# EAGLE design can4vscp_usb_rev_B (EAGLE 6.6.0)
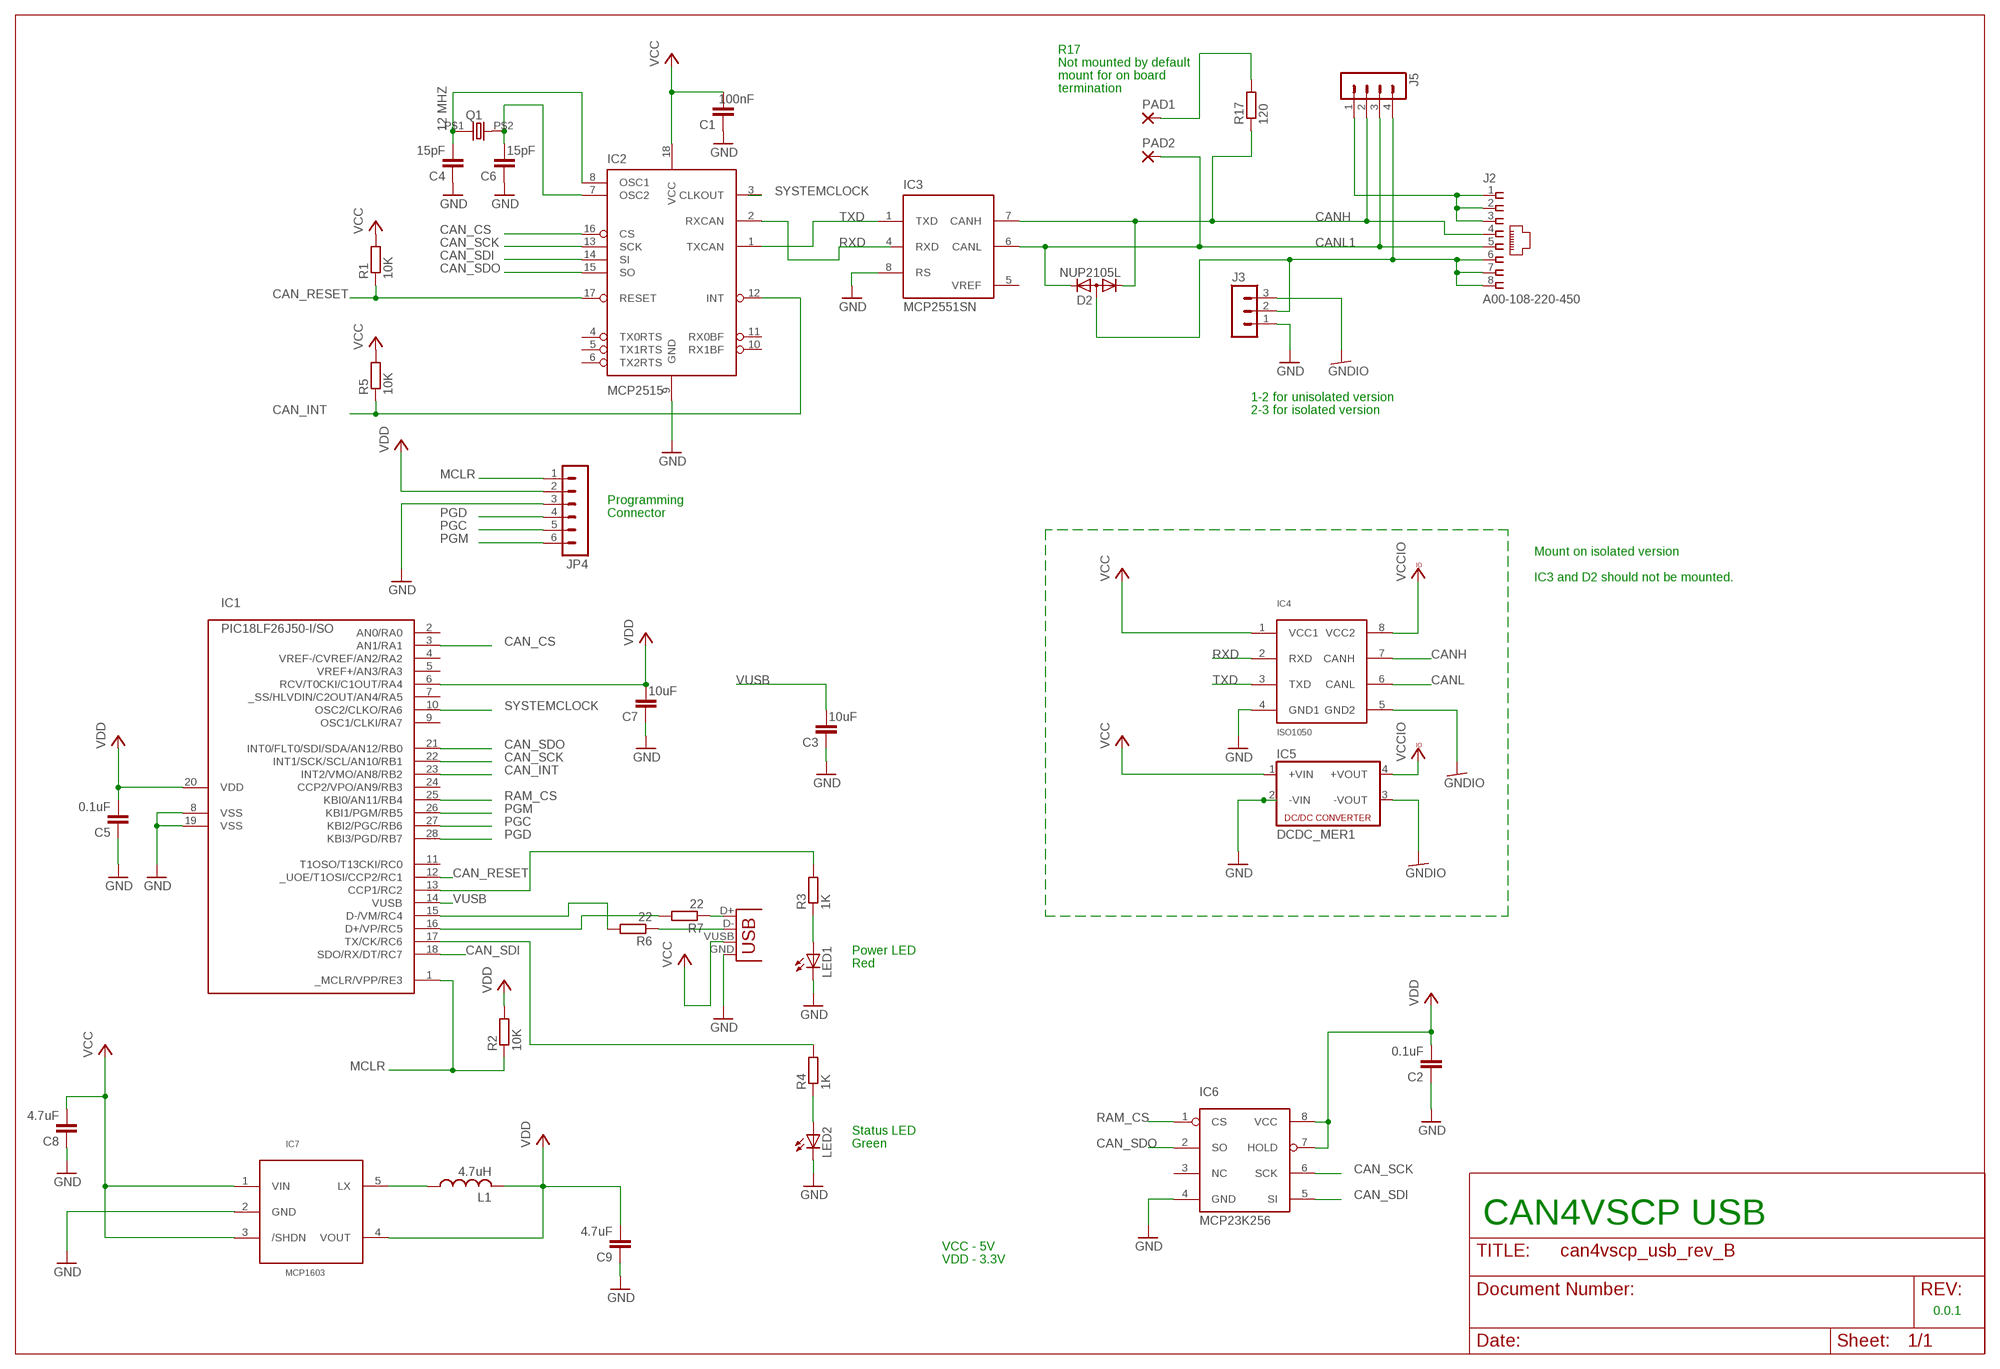
[diagram p0: schematic, sheet 1]

## Parts
C1  100nF  C-EUC0805  [C0805]
C2  0.1uF  C-EUC0805  [C0805]
C3  10uF  C-EUC0805  [C0805]
C4  15pF  C-EUC0805  [C0805]
C5  0.1uF  C-EUC0805  [C0805]
C6  15pF  C-EUC0805  [C0805]
C7  10uF  C-EUC0805  [C0805]
C8  4.7uF  C-EUC0805  [C0805]
C9  4.7uF  C-EUC0805  [C0805]
D2  NUP2105L  DIODE-2CA|ACSOT23  [SOT23]
IC1  PIC18LF26J50-I/SO  PIC18LF2550-I/SO  [SO-28W]
IC2  MCP2515  [SO-18W]
IC3  MCP2551SN  [SO-08]
IC4  ISO1050  [DUB_PSOP]
IC5  DCDC_MER1  [MER1]
IC6  MCP23K256  MCP23A256  [SO-8]
IC7  MCP1603  [SOT23-5L]
J2  A00-108-220-450  [RJ-45]
J3  MA03-1  [MA03-1]
J4  USB-B-S  [USB-B-SMT]
J5  MA04-1  [MA04-1]
JP4  MA06-1  [MA06-1]
L1  4.7uH  L-USL2012C  [L2012C]
LED1  LEDCHIP-LED0805  [CHIP-LED0805]
LED2  LEDCHIP-LED0805  [CHIP-LED0805]
PAD1  1,6/0,8  [1,6/0,8]
PAD2  1,6/0,8  [1,6/0,8]
Q1  12 MHZ  HC-49S  [9C]
R1  10K  R-EU_R0805  [R0805]
R2  10K  R-EU_R0805  [R0805]
R3  1K  R-EU_R0805  [R0805]
R4  1K  R-EU_R0805  [R0805]
R5  10K  R-EU_R0805  [R0805]
R6  22  R-EU_R0805  [R0805]
R7  22  R-EU_R0805  [R0805]
R17  120  R-EU_R0805  [R0805]

## Nets
CAN_CS: IC1.3(AN1/RA1) IC2.16(CS)
CAN_INT: IC1.23(INT2/VMO/AN8/RB2) IC2.12(INT) R5.1
CAN_RESET: IC1.12(_UOE/T1OSI/CCP2/RC1) IC2.17(RESET) R1.1
CAN_SCK: IC1.22(INT1/SCK/SCL/AN10/RB1) IC2.13(SCK) IC6.6(SCK)
CAN_SDI: IC1.18(SDO/RX/DT/RC7) IC2.14(SI) IC6.5(SI)
CAN_SDO: IC1.21(INT0/FLT0/SDI/SDA/AN12/RB0) IC2.15(SO) IC6.2(SO)
CANH: D2.1(K1) IC3.7(CANH) IC4.7(CANH) J2.4 J5.2 R17.1
CANL: IC4.6(CANL)
CANL1: D2.2(K2) IC3.6(CANL) J2.5 J5.3 PAD2.1(P)
GND: C1.1 C2.1 C3.1 C4.1 C5.1 C6.1 C7.1 C8.1 C9.1 IC1.8(VSS) IC1.19(VSS) IC2.9(GND) IC3.8(RS) IC4.4(GND1) IC5.2(-VIN) IC6.4(GND) IC7.2(GND) J3.1 J4.GND JP4.3 LED1.C LED2.C
GNDIO: IC4.5(GND2) IC5.3(-VOUT) J3.3
MCLR: IC1.1(_MCLR/VPP/RE3) JP4.1 R2.1
N$1: IC1.16(D+/VP/RC5) R7.2
N$2: C4.2 IC2.8(OSC1) Q1.P$1
N$3: IC1.15(D-/VM/RC4) R6.2
N$4: LED2.A R4.1
N$5: LED1.A R3.1
N$6: IC1.13(CCP1/RC2) R3.2
N$7: C6.2 IC2.7(OSC2) Q1.P$2
N$9: D2.3(A) J2.6 J2.7 J2.8 J3.2 J5.4
N$10: IC1.17(TX/CK/RC6) R4.2
N$11: PAD1.1(P) R17.2
N$12: J2.1 J2.2 J2.3 J5.1
N$13: J4.D- R6.1
N$14: J4.D+ R7.1
N$16: IC7.5(LX) L1.1
PGC: IC1.27(KBI2/PGC/RB6) JP4.5
PGD: IC1.28(KBI3/PGD/RB7) JP4.4
PGM: IC1.26(KBI1/PGM/RB5) JP4.6
RAM_CS: IC1.25(KBI0/AN11/RB4) IC6.1(CS)
RXD: IC2.2(RXCAN) IC4.2(RXD)
SYSTEMCLOCK: IC1.10(OSC2/CLKO/RA6) IC2.3(CLKOUT)
TXD: IC2.1(TXCAN) IC3.1(TXD) IC4.3(TXD)
VCC: C1.2 C8.2 IC2.18(VCC) IC4.1(VCC1) IC5.1(+VIN) IC7.1(VIN) IC7.3(/SHDN) J4.VUSB(VBUS) R1.2 R5.2
VCCIO: IC4.8(VCC2) IC5.4(+VOUT)
VDD: C2.2 C5.2 C7.2 C9.2 IC1.6(RCV/T0CKI/C1OUT/RA4) IC1.20(VDD) IC6.7(HOLD) IC6.8(VCC) IC7.4(VOUT) JP4.2 L1.2 R2.2
VUSB: C3.2 IC1.14(VUSB)
Unconnected: IC1.2(AN0/RA0) IC1.4(VREF-/CVREF/AN2/RA2) IC1.5(VREF+/AN3/RA3) IC1.7(_SS/HLVDIN/C2OUT/AN4/RA5) IC1.9(OSC1/CLKI/RA7) IC1.11(T1OSO/T13CKI/RC0) IC1.24(CCP2/VPO/AN9/RB3) IC2.4(TX0RTS) IC2.5(TX1RTS) IC2.6(TX2RTS) IC2.10(RX1BF) IC2.11(RX0BF) IC3.4(RXD) IC6.3(NC)

## Notes on the sheet
- R17
- Not mounted by default
- mount for on board
- termination
- 1-2 for unisolated version
- 2-3 for isolated version
- Programming
- Connector
- Mount on isolated version
- IC3 and D2 should not be mounted.
- Power LED
- Red
- Status LED
- Green
- CAN4VSCP USB
- VCC - 5V
- VDD - 3.3V
- 0.0.1

## Power pins joined to a net without a drawn wire
GND: IC3.2(VSS)
VCC: IC3.3(VDD)
VREF: IC3.5(VREF)

## Library data of the parts
C1-C9 = rcl:C-EU: CAPACITOR, European symbol
D2 = diode:DIODE-2CA|AC: Dual DIODE Cathode-Anode|Anode-Cathode
IC1 = microchip-pic18fxx5x:PIC18*2550: PIC18*2550 Microchip FLASH Microcontroller with FS-USB DEVICE FEATURES Feature PIC18*2550 Program Memory (bytes) 32k Program Memory (instructions) 16384 I/O Ports Ports A, B, C, (E) Capture/Compare/PWM Modules 2 Enhanced Capture/Compare/PWM Modules 0 Parallel Communications (PSP) No 10-bit Analog-to-Digital Module 10 input Channels Package Types 28-pin PDIP 28-pin SOIC NOTES: F only after 18, means standard voltage range from 4.2v to 5.5v LF after 18, means extended voltage range from 2.0v to 5.5v T after entire device number, means supplied in tape and reel TQFP packages only -E before / denotes extended temperature range from -40°C to +120°C -I before / denotes industrial temperature range from -40°C to +85°C /PT suffix denotes TQFP package /SO suffix denotes SOIC package /SP suffix denotes Skinny Plastic DIP package /P suffix denotes Plastic DIP package /ML suffix denotes QFN package
IC2 = vscpcan:MCP2515
IC3 = microchip_can:MCP2551: High Speed CAN tranceiver
IC4 = vscpcan:ISO1050
IC5 = vscpcan:DCDC_MER1
IC6 = vscpcan:MCP23A256
IC7 = eurosource_mcp1603:MCP1603
J2 = vscpcan:A00-108-220-450
J3 = con-lstb:MA03-1: PIN HEADER; OC_FARNELL: unknown; OC_NEWARK: unknown
J4 = con-usb:USB: USB Connectors
J5 = con-lstb:MA04-1: PIN HEADER; OC_FARNELL: unknown; OC_NEWARK: unknown
JP4 = con-lstb:MA06-1: PIN HEADER; OC_FARNELL: unknown; OC_NEWARK: unknown
L1 = rcl:L-US: INDUCTOR, American symbol
LED1 LED2 = led:LED: LED OSRAM: - CHIPLED LG R971, LG N971, LY N971, LG Q971, LY Q971, LO R971, LY R971 LH N974, LH R974 LS Q976, LO Q976, LY Q976 LO Q996 - Hyper CHIPLED LW Q18S LB Q993, LB Q99A, LB R99A - SideLED LS A670, LO A670, LY A670, LG A670, LP A670 LB A673, LV A673, LT A673, LW A673 LH A674 LY A675 LS A676, LA A676, LO A676, LY A676, LW A676 LS A679, LY A679, LG A679 - Hyper Micro SIDELED® LS Y876, LA Y876, LO Y876, LY Y876 LT Y87S - SmartLED LW L88C, LW L88S LB L89C, LB L89S, LG L890 LS L89K, LO L89K, LY L89K LS L896, LA L896, LO L896, LY L896 - TOPLED LS T670, LO T670, LY T670, LG T670, LP T670 LSG T670, LSP T670, LSY T670, LOP T670, LYG T670 LG T671, LOG T671, LSG T671 LB T673, LV T673, LT T673, LW T673 LH T674 LS T676, LA T676, LO T676, LY T676, LB T676, LH T676, LSB T676, LW T676 LB T67C, LV T67C, LT T67C, LS T67K, LO T67K, LY T67K, LW E67C LS E67B, LA E67B, LO E67B, LY E67B, LB E67C, LV E67C, LT E67C LW T67C LS T679, LY T679, LG T679 LS T770, LO T770, LY T770, LG T770, LP T770 LB T773, LV T773, LT T773, LW T773 LH T774 LS E675, LA E675, LY E675, LS T675 LS T776, LA T776, LO T776, LY T776, LB T776 LHGB T686 LT T68C, LB T68C - Hyper Mini TOPLED® LB M676 - Mini TOPLED Santana® LG M470 LS M47K, LO M47K, LY M47K Source: http://www.osram.convergy.de LUXEON: - LUMILED® LXK2-PW12-R00, LXK2-PW12-S00, LXK2-PW14-U00, LXK2-PW14-V00 LXK2-PM12-R00, LXK2-PM12-S00, LXK2-PM14-U00 LXK2-PE12-Q00, LXK2-PE12-R00, LXK2-PE12-S00, LXK2-PE14-T00, LXK2-PE14-U00 LXK2-PB12-K00, LXK2-PB12-L00, LXK2-PB12-M00, LXK2-PB14-N00, LXK2-PB14-P00, LXK2-PB14-Q00 LXK2-PR12-L00, LXK2-PR12-M00, LXK2-PR14-Q00, LXK2-PR14-R00 LXK2-PD12-Q00, LXK2-PD12-R00, LXK2-PD12-S00 LXK2-PH12-R00, LXK2-PH12-S00 LXK2-PL12-P00, LXK2-PL12-Q00, LXK2-PL12-R00 Source: www.luxeon.com KINGBRIGHT: KA-3528ASYC Source: www.kingbright.com
PAD1 PAD2 = wirepad:1,6/0,8: THROUGH-HOLE PAD
Q1 = vscpcan:HC-49S: Digikey 887-1050-1-nd
R1-R7 R17 = rcl:R-EU_: RESISTOR, European symbol

## Board
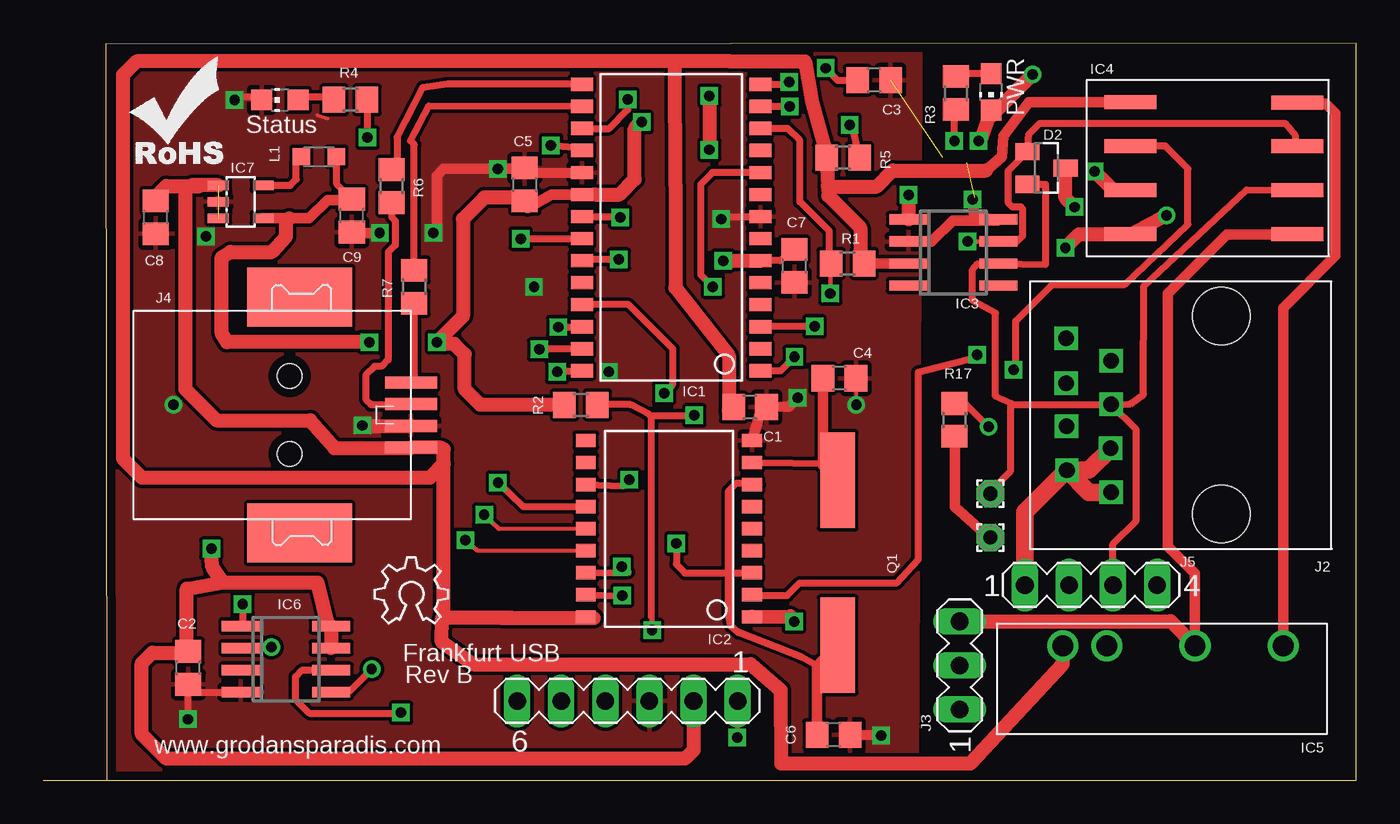
[diagram p1: board, top side]
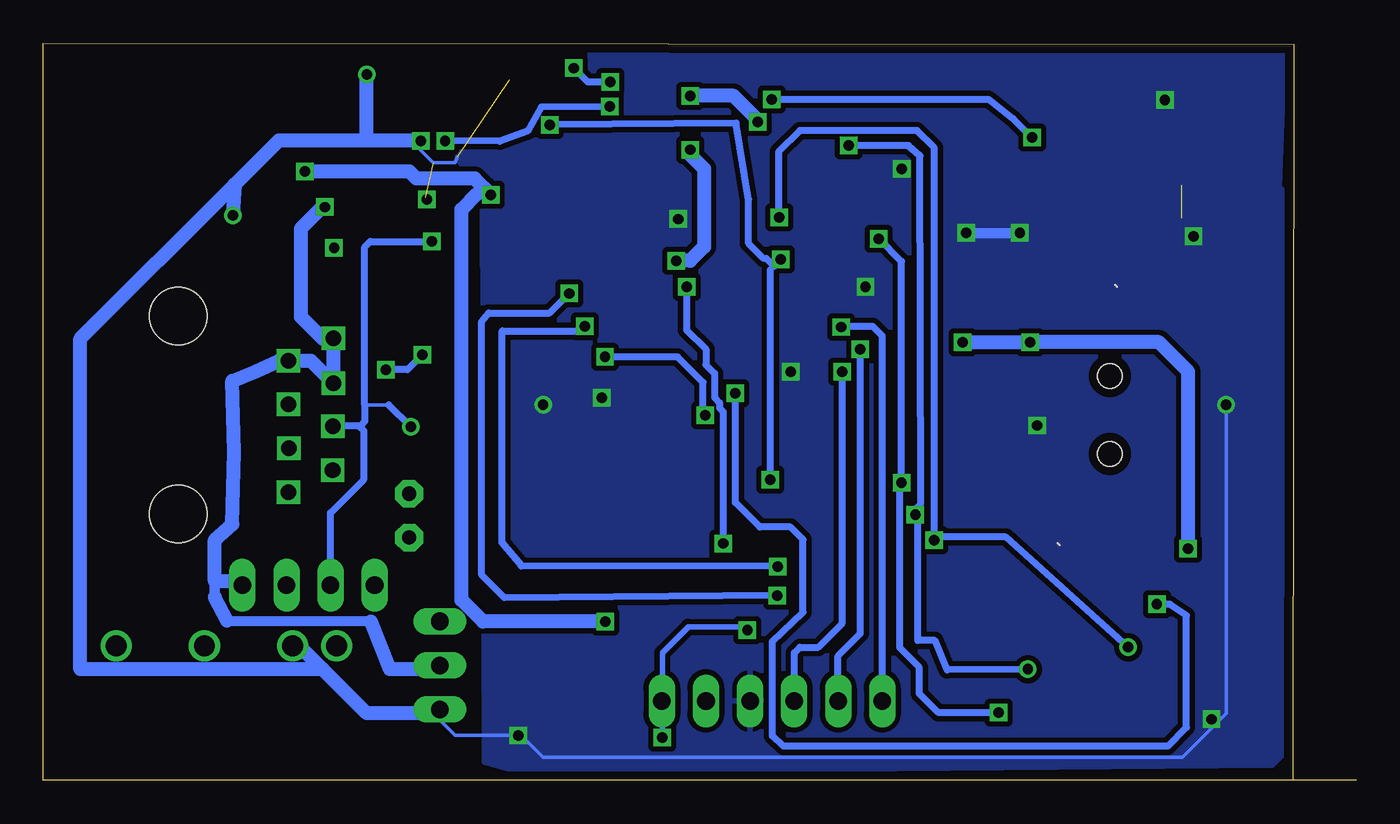
[diagram p2: board, bottom side, seen from below]

Size 75.66 x 42.48 mm. Coordinates in mm from the lower left corner, seen from the top.
Outline: 0,0 75.66,0 75.66,42.48 3.59,42.43 3.64,0.01
Copper layers (1*16): Top 0.035mm / dielectric 1.5mm / Bottom 0.035mm
Design rules "8mils": minimum track width 8mil, minimum drill 0.6mm, track to track 8mil, track to pad 8mil, pad to pad 8mil, via to via 8mil, smd to smd 0mil, copper to edge 20mil, drill to drill 10mil, minimum pad ring 8mil, minimum via ring 8mil, stop-mask expansion 0mil, vias tented up to drill 0mil, thermal gap 10mil

### Footprints (pad centres in the part's own frame; a part is rotated, then mirrored left to right if it is on the bottom)
C0805 = smd 1.3 x 1.5: 1 -0.95,0; 2 0.95,0
SOT23 = smd 1 x 1.4: 1 -0.95,-1.1; 2 0.95,-1.1; 3 0,1.1
SO-28W = smd 0.762 x 1.27: 1 -7.62,-5.207; 2 -6.35,-5.207; 3 -5.08,-5.207; 4 -3.81,-5.207; 5 -2.54,-5.207; 6 -1.27,-5.207; 7 0,-5.207; 8 1.27,-5.207; 9 2.54,-5.207; 10 3.81,-5.207; 11 5.08,-5.207; 12 6.35,-5.207; 13 7.62,-5.207; 14 8.89,-5.207; 15 8.89,5.08; 16 7.62,5.08; 17 6.35,5.08; 18 5.08,5.08; 19 3.81,5.08; 20 2.54,5.08; 21 1.27,5.08; 22 0,5.08; 23 -1.27,5.08; 24 -2.54,5.08; 25 -3.81,5.08; 26 -5.08,5.08; 27 -6.35,5.08; 28 -7.62,5.08
SO-18W = smd 0.762 x 1.143: 1 -5.08,-4.788; 2 -3.81,-4.788; 3 -2.54,-4.788; 4 -1.27,-4.788; 5 0,-4.788; 6 1.27,-4.788; 7 2.54,-4.788; 8 3.81,-4.788; 9 5.08,-4.788; 10 5.08,4.788; 11 3.81,4.788; 12 2.54,4.788; 13 1.27,4.788; 14 0,4.788; 15 -1.27,4.788; 16 -2.54,4.788; 17 -3.81,4.788; 18 -5.08,4.788
SO-08 = smd 0.6 x 2.2: 1 -1.905,-2.6; 2 -0.635,-2.6; 3 0.635,-2.6; 4 1.905,-2.6; 5 1.905,2.6; 6 0.635,2.6; 7 -0.635,2.6; 8 -1.905,2.6
DUB_PSOP = smd 0.8 x 3: 1 -2.54,0; 2 0,0; 3 2.54,0; 4 5.08,0; 5 5.08,9.6; 6 2.54,9.6; 7 0,9.6; 8 -2.5,9.6
MER1 = drill 1.2: 1 -5.08,0; 2 -2.54,0; 3 2.54,0; 4 7.62,0
SO-8 = smd 0.6 x 2.2: 1 -1.905,-2.6; 2 -0.635,-2.6; 3 0.635,-2.6; 4 1.905,-2.6; 5 1.905,2.6; 6 0.635,2.6; 7 -0.635,2.6; 8 -1.905,2.6
SOT23-5L = smd 0.55 x 1.2: 1 -0.95,-1.3; 2 0,-1.3; 3 0.95,-1.3; 4 0.95,1.3; 5 -0.95,1.3
RJ-45 = drill 0.9 square: 1 -4.45,6.35; 2 -3.17,8.89; 3 -1.92,6.36; 4 -0.65,8.91; 5 0.62,6.35; 6 1.84,8.93; 7 3.14,6.35; 8 4.42,8.93 | hole 3.3: -5.7,0; 5.7,0
MA03-1 = drill 1.016 long: 1 -2.54,0; 2 0,0; 3 2.54,0
USB-B-SMT = smd 6.04 x 3.4: 5 0.58,6.8; 6 0.58,-6.8 | smd 3 x 0.7: D+ 7,1.875; D- 7,0.625; GND 7,-0.625; VUSB 7,-1.875 | hole 1.4: 0,2.25; 0,-2.25
MA04-1 = drill 1.016 long: 1 -3.81,0; 2 -1.27,0; 3 1.27,0; 4 3.81,0
MA06-1 = drill 1.016 long: 1 -6.35,0; 2 -3.81,0; 3 -1.27,0; 4 1.27,0; 5 3.81,0; 6 6.35,0
L2012C = smd 1 x 1: 1 -1,0; 2 1,0
CHIP-LED0805 = smd 1.2 x 1.2: A 0,-1.05; C 0,1.05
1,6/0,8 = drill 0.813 pad 1.6 octagon: 1 0,0
9C = smd 5.5 x 2: P$1 -4.74,0; P$2 4.76,0
R0805 = smd 1.3 x 1.5: 1 -0.95,0; 2 0.95,0

### Placement (x,y rotation side)
C1  40.73,21.5 180 top
C2  8.35,6.48 90 top
C3  47.88,40.35 180 top
C4  45.88,23.17 180 top
C5  27.74,34.34 270 top
C6  45.55,2.63 180 top
C7  43.28,29.65 90 top
C8  6.48,32.45 90 top
C9  17.78,32.55 90 top
D2  57.81,35.29 270 top
IC1  36.12,31.22 90 top
IC2  36.05,14.5 90 top
IC3  52.45,30.42 270 top
IC4  62.66,36.56 270 top
IC5  63.84,7.75 0 top
IC6  13.98,6.99 270 top
IC7  11.38,33.35 270 top
J2  67.88,21.05 90 top
J3  52.81,6.62 90 top
J4  14.19,21.06 0 top
J5  60.38,11.25 0 top
JP4  33.66,4.57 180 top
L1  15.88,35.95 0 top
LED1  54.63,39.68 180 top
LED2  13.63,39.22 90 top
PAD1  54.58,13.99 0 top
PAD2  54.58,16.52 0 top
Q1  45.78,12.55 270 top
R1  46.35,29.79 0 top
R2  30.98,21.64 180 top
R3  52.6,39.61 270 top
R4  17.7,39.22 0 top
R5  46.09,35.89 180 top
R6  20.08,34.25 90 top
R7  21.38,28.45 90 top
R17  52.51,20.77 270 top
U$1  [OSHW_6X150_NOTEXT]  19.08,9.05 0 top
U$2  [ROHS_SILK]  7.08,37.95 0 top
U$3  [VSCP_LOGO2]  21.58,36.85 0 top

### Tracks (layer width: path | path; a pad name or v marks a point on that pad's centre or on a via)
CAN_CS  (via drill 0.6)
  Top 0.254: 41.34,26.16 IC1.3
  Top 0.406: IC2.16 33.71,11.99 v33.33,12.32 | v44.45,26.16 41.34,26.16
  Bottom 0.254: 44.71,25.9 v44.45,26.16
  Bottom 0.406: v33.33,12.32 48.1,12.35 49.23,13.69 49.23,25.34 49.21,25.9 44.71,25.9
CAN_INT  (via drill 0.6)
  Top 0.254: 33.42,16.98 v33.77,17.32 | 31.1,30.02 IC1.23 | v46.46,37.78 46.54,37.91
  Top 0.406: IC2.12 33.42,16.98 | v33.17,30.02 31.1,30.02 | 46.54,37.91 R5.1
  Bottom 0.254: 33.77,29.42 33.55,29.64 v33.17,30.02 | 33.99,30.07 34.15,30.07
  Bottom 0.406: v33.77,17.32 33.77,29.42 | v46.46,37.78 35.73,37.88 35.02,33.47 35.02,30.95 34.15,30.07 | 33.55,29.64 33.99,30.07
CAN_RESET  (via drill 0.6)
  Top 0.254: 45.29,29.8 R1.1 45.36,29.73 v45.36,28.06 | 33.56,10.63 v33.36,10.65
  Top 0.406: IC1.12 42.91,37.57 43.6,36.89 43.6,33.36 45.29,31.66 45.29,29.8 | IC2.17 33.56,10.63
  Bottom 0.406: v33.36,10.65 49.08,10.52 50.39,11.83 50.39,26.45 50,26.95 46.47,26.95 v45.36,28.06
CAN_SCK  (via drill 0.6)
  Top 0.254: IC1.22 | 20.58,3.86 v20.61,3.89
  Top 0.406: IC2.13 27.66,15.78 v26.2,17.16 | v27.51,31.22 IC1.22 | IC6.6 14.92,6.35 14.54,5.97 14.54,4.65 15.32,3.86 20.58,3.86
  Bottom 0.254: 26.31,17.06 v26.2,17.16
  Bottom 0.406: v26.2,17.16 26.2,29.91 v27.51,31.22 | v20.61,3.89 24.07,3.89 25.17,4.99 25.17,6.5 26.31,7.64 26.31,17.06
CAN_SDI  (via drill 0.6)
  Top 0.203: IC6.5 17.65,5.13
  Top 0.254: IC2.14 26.27,14.48 v25.4,15.3 | 30.89,36.45 IC1.18
  Top 0.406: v29.25,36.6 30.89,36.45 | 17.65,5.13 v18.92,6.4
  Bottom 0.203: 25.27,15.29 v25.4,15.3
  Bottom 0.254: 29.16,36.59 v29.25,36.6
  Bottom 0.406: v25.4,15.3 25.4,15.62 25.08,15.94 25.13,36 25.79,36.59 29.16,36.59 | v18.92,6.4 23.58,6.35 24.28,8.05 25.27,8.05 25.27,15.29
CAN_SDO  (via drill 0.6)
  Top 0.203: IC6.2 11.3,7.67
  Top 0.254: IC2.15 24.99,13.24 v24.31,13.85 | 31.07,32.46 IC1.21
  Top 0.406: v33.25,32.46 31.07,32.46 | 11.3,7.67 v13.14,7.67
  Bottom 0.203: 24,14.02 v24.31,13.85
  Bottom 0.254: 33.29,32.5 v33.25,32.46
  Bottom 0.406: v24.31,13.85 24.31,36.45 25.31,37.45 32.07,37.45 33.29,36.23 33.29,32.5 | v13.14,7.67 20.19,14.02 24,14.02
CANH  (via drill 0.6)
  Top 0.203: R17.1 53.21,21.64
  Top 0.254: 72.15,36.66 IC4.7 | 56.12,31.05 IC3.7 v53.27,31.05 | 56.45,32.94 56.34,33.05
  Top 0.406: 72.15,36.66 72.15,37.18 71.56,37.87 57.42,37.87 56.81,37.26 D2.1 55.61,35.14 55.61,33.28 55.84,33.05 56.34,33.05 | 56.12,31.05 56.45,31.39 56.45,32.94 | 53.21,21.64 v54.48,20.37
  Bottom 0.203: 55.75,21.64 57.14,21.64
  Bottom 0.254: 57.39,20.44 57.48,20.44 | 58.94,20.44 J2.4
  Bottom 0.406: v53.27,31.05 56.82,31.05 57.14,30.74 57.14,21.64 57.14,20.69 57.39,20.44 | 58.94,20.44 57.48,20.44 57.18,20.14 57.18,17.35 59.11,15.42 J5.2 | v54.48,20.37 55.75,21.64
CANL
  Top 0.203: 62.1,21.67 62.1,21.64
  Top 0.406: IC4.6 69.35,34.04 63.41,28.48 63.41,22.25 62.64,21.7 62.1,21.67 61.63,21.64
CANL1
  Top 0.203: PAD2.1 54.48,16.56 | 55.75,21.64 55.79,21.72
  Top 0.254: 55.79,21.72 55.94,21.66 | 53.84,29.77 IC3.6 | 61.53,21.66 J2.5
  Top 0.406: 55.79,21.72 54.88,22.13 54.88,26.93 53.55,27.66 53.55,29.43 53.84,29.77 | IC3.6 57.78,29.74 57.78,32.32 57.78,34.34 D2.2 | 55.94,21.66 61.53,21.66 | 54.48,16.56 55.75,17.83 55.75,21.64 | J5.3 61.65,13.62 62.98,14.95 62.98,20.22 J2.5
GND  (via drill 0.6)  (2 unrouted)
  Top 0.203: 12.57,39.42 LED2.C | v46.86,21.64 46.86,22.91 C4.1 | 54.48,38.15 LED1.C | 62.77,31.5 IC4.4 | 16.38,38.15 15.77,38.34
  Top 0.254: 8.35,5.08 C2.1 | IC3.2 51.2,31.05 52.25,32.1 53.38,32.1 53.7,32.41 53.7,33.55 53.65,33.59
  Top 0.305: v18.38,20.45 18.4,20.43
  Top 0.406: IC1.8 39.22,32.49 v39.08,32.35 | v53.89,36.86 54.03,36.9 | 12.57,39.42 11.3,39.42 v11.02,39.22 | IC6.4 8.35,5.08 8.35,3.98 v8.34,3.51
  Top 0.61: IC1.19 28.38,34.99 C5.1 27.83,35.25 v26.18,35.25 23.08,35.25 22.68,34.85 22.68,31.75 v22.48,31.55 | C6.1 v48.27,2.58 v48.28,2.59 | v43.48,22.05 42.98,21.55 C1.1 41.29,21.12 IC2.9 | v53.56,33.49 53.64,32.48 IC3.8 54.98,32.26 52.43,32.26 51.18,31.05 IC3.2 | v58.9,30.69 58.95,30.95 | v19.38,31.55 17.83,31.55 C9.1
  Top 0.813: 18.4,20.43 J4.GND | 54.03,36.9 LED1.C | IC4.4 59.69,31.48 v58.9,30.69 | v57.02,40.69 54.48,38.15 | v64.74,32.57 62.77,31.5
  Bottom 0.203: 54.48,36.88 53.21,35.61 51.94,35.61 51.81,35.91 | 48.13,2.59 51.94,2.59 53.21,3.86 J3.1 | 48.13,2.59 46.86,1.32 10.03,1.32 7.49,3.86 v7.49,21.64 | 48.13,2.59 v48.28,2.59
  Bottom 0.61: v22.48,31.55 v19.38,31.55
  Bottom 0.813: 57.02,36.88 v57.02,40.69 | 54.48,36.88 57.02,36.88 | 57.02,36.88 62.1,36.88 64.64,34.34 | 59.56,6.4 57.02,3.86 53.21,3.86 | 59.56,6.4 60.83,7.67 IC5.2 | 64.64,34.34 73.53,25.45 73.53,6.4 59.56,6.4 | 64.64,34.34 v64.74,32.57
  other vias: 9.38,31.35 28.28,28.45 32.58,23.55
  pour Bottom (isolate 0.305): 4.27,34.09 4.27,1.45 4.86,0.86 48.15,0.46 50.22,1.03 50.35,33.63 55.64,41.81 4.14,41.79 4.42,34.17
  pour Top: 4.27,42.07 4.27,0.42 4.41,0.27 49.61,0.47 50.35,0.42 50.55,40.87 50.56,42.17
GNDIO
  Top 0.203: 64.64,16.56 64.81,16.56
  Top 0.61: IC5.3 66.38,11.92 64.81,13.49 64.81,16.56 64.81,28.06 68.21,31.46 72.24,31.46 IC4.5
  Top 0.813: J3.3 64.97,9.16 IC5.3
MCLR  (via drill 0.6)
  Top 0.254: 35.05,21.02 34.93,21.08 34.98,21.03 | R2.1
  Top 0.305: JP4.1 40.01,2.68 v39.98,2.45 | v35.08,8.65 35.08,9.4 35.05,9.43
  Top 0.406: 35.05,9.43 35.05,21.02 | 34.93,21.08 33.83,21.65 R2.1 | IC1.1 42.49,23.6 v43.29,24.41 | 34.98,21.03 v37.52,21.03
  Bottom 0.254: v37.52,21.03 37.63,21.14
  Bottom 0.305: v39.98,2.45 39.98,7.35 38.48,8.85 35.28,8.85 v35.08,8.65
  Bottom 0.406: v43.29,24.41 39.1,24.41 37.63,22.94 37.63,21.14
N$1
  Top 0.254: IC1.16
  Top 0.406: IC1.16 22.22,38.89 21.15,36.86 21.38,36.63 R7.2
N$2
  Top 0.254: 45.54,18.25 46.03,17.75 45.78,17.5 Q1.P$1
  Top 0.406: IC2.8 45.54,18.25
  Top 0.61: C4.2 44.93,18.14 Q1.P$1
N$3
  Top 0.254: IC1.15 31.07,40.15
  Top 0.406: IC1.15 31,40.15 23.28,40.15 21.88,39.95 20.38,37.05 20.38,35.5 R6.2
N$4
  Top 0.203: LED2.A 15.11,39.42 | 16.38,39.42 R4.1
  Top 0.406: 15.11,39.42 16.38,39.42
N$5
  Top 0.406: LED1.A 52.77,40.73 R3.1
N$6  (via drill 0.6)
  Top 0.254: 43.2,38.84 v43.01,38.84
  Top 0.406: IC1.13 43.2,38.84 | v52.51,36.87 52.51,38.56 R3.2
  Bottom 0.406: v43.01,38.84 46.97,38.81 47.77,37.43 49.34,36.83 v52.51,36.87
N$7
  Top 0.254: 41.34,17.03 IC2.7 40.74,17.14
  Top 0.406: 44.6,6.61 43.66,7.11 40.06,8.52 39.62,8.89 39.49,9.5 39.49,16.68 39.94,17.14 40.74,17.14
  Top 0.61: C6.2 44.6,6.61 Q1.P$2
N$9  (via drill 0.6)
  Top 0.813: D2.3 58.91,33.57 v59.44,33.04
  Bottom 0.203: J3.2 53.21,6.4 | v59.44,33.04 59.56,33.07 | 65.91,11.48 65.78,11.48 | 59.56,25.45 J2.8
  Bottom 0.61: 56.78,9.15 65.08,9.2 | 65.78,10.55 65.78,11.48 | 62.1,24.18 J2.7
  Bottom 0.813: 53.21,6.4 55.68,6.4 56.78,9.15 | 65.08,9.2 65.78,10.55 | 62.1,24.18 63.38,23.58 64.78,23.03 64.67,18.92 64.77,14.76 65.78,13.85 65.78,11.48 64.64,11.48 J5.4 | 59.56,33.07 60.83,31.8 60.83,26.72 59.56,25.45 | J2.8 J2.6 60.25,24.19 J2.7
N$10  (via drill 0.6)
  Top 0.254: R4.2 18.7,39.27
  Top 0.406: IC1.17 32.6,37.57 33.68,38.65 v33.68,39.25 | 18.68,39.25 R4.2 18.65,37.08 v18.68,37.05
  Bottom 0.406: v33.68,39.25 21.18,39.25 19.78,38.15 v18.68,37.05
N$11
  Top 0.203: 52.54,19.57 R17.2 | PAD1.1 54.48,14.02
  Top 0.61: 52.54,19.57 52.54,15.76 54.48,14.02
N$12
  Top 1.016: J5.1 56.57,15.46 J2.2 | J2.2 60.27,17.88 J2.3 | J2.1 60.27,16.6 J2.2
N$13
  Top 0.406: R6.1 20.08,32.45 20.28,32.25 20.28,30.85 19.88,30.45 19.88,24.25 19.48,23.85 19.08,23.85 18.58,23.35 18.58,21.95 18.88,21.65 21.16,21.65 J4.D-
N$14
  Top 0.406: R7.1 21.38,23.12 J4.D+
N$16
  Top 0.406: IC7.5 14.23,34.3 14.58,34.65 14.58,35.65 L1.1
PGC  (via drill 0.6)
  Top 0.254: v28.57,24.83 28.61,24.87
  Top 0.406: 28.61,24.87 IC1.27
  Bottom 0.254: JP4.5 29.86,4.58
  Bottom 0.406: v28.57,24.83 28.57,8.46 29.86,7.17 29.86,4.58
PGD  (via drill 0.6)
  Top 0.254: v29.61,23.54 29.67,23.6
  Top 0.406: 29.67,23.6 IC1.28
  Bottom 0.254: JP4.4
  Bottom 0.406: v29.61,23.54 29.61,9.06 31,7.67 32.07,7.67 32.38,7.36 JP4.4
PGM  (via drill 0.6)
  Top 0.254: 31.02,26.12 IC1.26
  Top 0.406: v29.67,26.12 31.02,26.12
  Bottom 0.254: 29.64,26.16 v29.67,26.12
  Bottom 0.406: JP4.6 27.31,25.62 27.85,26.16 29.64,26.16
RAM_CS  (via drill 0.6)
  Top 0.254: 11.48,8.99 IC6.1
  Top 0.406: IC1.25 33.73,27.41 36.28,24.86 36.28,22.82 v35.78,22.31 | v11.48,10.14 11.48,8.99
  Bottom 0.406: v35.78,22.31 35.78,16.01 34.36,14.6 32.6,14.6 31.88,13.87 31.88,9.68 33.65,8.01 33.65,2.56 33.01,1.97 10.86,1.97 9.79,3.04 9.79,9.5 10.73,10.14 v11.48,10.14
RXD  (via drill 0.6)
  Top 0.254: v55.91,23.67 56.05,23.99 | IC2.2 40.88,10.65
  Top 0.406: IC4.2 64.66,36.56 65.97,35.25 65.97,32.03 62.32,28.57 58.14,28.57 56.05,26.48 56.05,23.99 | v53.83,24.52 53.83,24.4 50.43,23.52 50.43,12.73 49.21,11.39 43.58,11.37 42.86,10.65 40.88,10.65
  Bottom 0.406: v55.91,23.67 54.68,23.67 v53.83,24.52
SYSTEMCLOCK  (via drill 0.6)
  Top 0.406: IC1.10 38.56,35.03 37.88,34.35 37.88,29.15 v38.58,28.45 | v36.48,13.65 36.48,12.45 36.98,11.95 40.82,11.95 IC2.3
  Bottom 0.406: v38.58,28.45 38.58,25.95 37.48,24.85 37.48,23.95 36.98,23.45 36.98,22.05 36.68,21.75 36.68,21.45 36.48,21.25 v36.48,13.65
TXD  (via drill 0.6)
  Top 0.254: 49.87,32.34 IC3.1 | 61.66,34.02 IC4.3
  Top 0.406: 43.06,9.46 v43.27,9.15
  Top 0.813: IC2.1 43.06,9.46 | v49.87,33.75 49.87,32.34 | v60.59,35.09 61.66,34.02
  Bottom 0.254: 49.93,33.82 v49.87,33.75
  Bottom 0.406: 50.65,33.82 49.93,33.82
  Bottom 0.813: v43.27,9.15 50.32,9.15 51.57,10.39 51.57,32.9 50.65,33.82 | v60.59,35.09 54.56,35.09 54.15,34.68 50.8,34.68 v49.87,33.75
VCC  (1 unrouted)
  Top 0.203: 36.7,34.34 36.42,34.34
  Top 0.61: 45.18,35.94 R5.2 | 47.08,29.81 R1.2 IC3.3 | 23.11,9.43 26.44,9.36 | 31.71,9.36 IC2.18 27.08,9.36 | 36.43,28.38 36.53,28.28 | 39.51,21.3 C1.2 | 36.41,41.41 39.59,41.45 | IC4.1 56.8,39.1 55.33,37.13 55.23,35.95 54.34,35.15 | 45.21,34.25 45.23,34.23
  Top 0.813: 45.18,35.94 44.28,39.25 43.88,41.45 39.59,41.45 5.38,41.45 4.58,40.65 4.58,18.55 5.68,17.45 22.28,17.45 23.08,18.25 | R5.2 45.21,34.25 45.24,33.69 47.08,31.85 47.08,29.81 | 23.11,9.43 22.99,9.37 22.96,7.98 24.76,6.68 40.77,6.68 42.49,5.2 42.52,0.97 53.42,0.97 58.76,6.7 IC5.1 | 26.44,9.36 31.71,9.36 | 27.08,9.36 23.05,9.37 23.08,18.25 | 23.08,18.25 23.08,19.08 22.89,19.18 J4.VUSB 21.16,19.15 16.78,19.15 15.38,20.75 9.98,20.75 8.18,22.55 8.18,33.95 8.53,34.3 9.08,34.3 | 36.43,28.38 36.42,34.34 36.41,41.41 | 36.53,28.28 39.51,24.48 39.51,21.3 | 54.34,35.15 48.95,35.15 48.03,34.23 45.23,34.23 | IC7.1 9.08,34.3 | C8.2 6.48,33.65 7.08,34.25 9.03,34.25 9.08,34.3
VCCIO
  Top 0.61: IC5.4 71.46,27.23 74.47,30.24 74.47,38.45 73.92,39 72.32,39 IC4.8
VDD  (via drill 0.6)
  Top 0.203: C2.2 8.26,7.57 | 16.38,8.94 IC6.8 | C5.2 27.81,33.07
  Top 0.254: 31.79,33.76 IC1.20
  Top 0.406: C7.2 43.13,30.6 42.48,29.95 IC1.6 | L1.2 16.88,34.4 C9.2 | 27.81,33.07 27.9,32.97 | 31.02,33.75 IC1.20
  Top 0.61: IC7.4 14.18,32.4 15.33,32.4 16.38,33.45 17.73,33.45 C9.2 | 28.07,33.76 C5.2 27.32,33.59 | 27.9,32.97 29.28,33.75 31.02,33.75
  Top 0.813: IC6.8 IC6.7 | 8.26,7.57 8.26,11.04 10.33,11.4 | 10.33,11.4 15.78,11.4 16.38,8.94 | 27.32,33.59 25.42,33.59 24.18,32.35 24.18,26.75 v22.68,25.25 22.78,25.15 23.68,25.15 24.28,24.55 24.28,22.55 25.18,21.64 R2.2 | v18.78,25.25 10.58,25.25 10.28,25.75 10.28,30.15 10.78,30.45 13.18,30.45 13.98,31.35 13.98,32.2 14.18,32.4 | 10.33,11.4 9.73,12.3 v9.68,13.35 | 31.79,33.76 33.19,33.76 34.08,34.65 34.08,37.55 v34.48,37.95 | v38.38,39.45 v38.38,36.35 | v39.18,29.95 IC1.6 | JP4.2 37.47,1.74 36.98,1.25 7.08,1.25 5.68,2.65 5.68,6.75 6.28,7.35 8.27,7.35 C2.2
  Bottom 0.813: v22.68,25.25 v18.78,25.25 11.38,25.25 9.68,23.55 v9.68,13.35 | v34.48,37.95 34.48,38.05 35.88,39.45 v38.38,39.45 | v38.38,36.35 38.38,36.05 37.58,35.25 37.58,30.75 38.38,29.95 v39.18,29.95
VUSB  (via drill 0.6)
  Top 0.406: IC1.14 42.84,40.11 v42.98,40.25 | v45.08,41.05 45.78,40.35 C3.2
  Bottom 0.406: v42.98,40.25 44.28,40.25 v45.08,41.05

### Text on the board
tPlace: PWR | Status
tNames: Frankfurt USB | Rev B | www.grodansparadis.com